# EAGLE design AU_MacroPad (EAGLE 9.6.2)
COMPANY: ADAFRUIT INDUSTRIES; DRAWN: KTOWN; REV: A

## Sheet 1 of 2
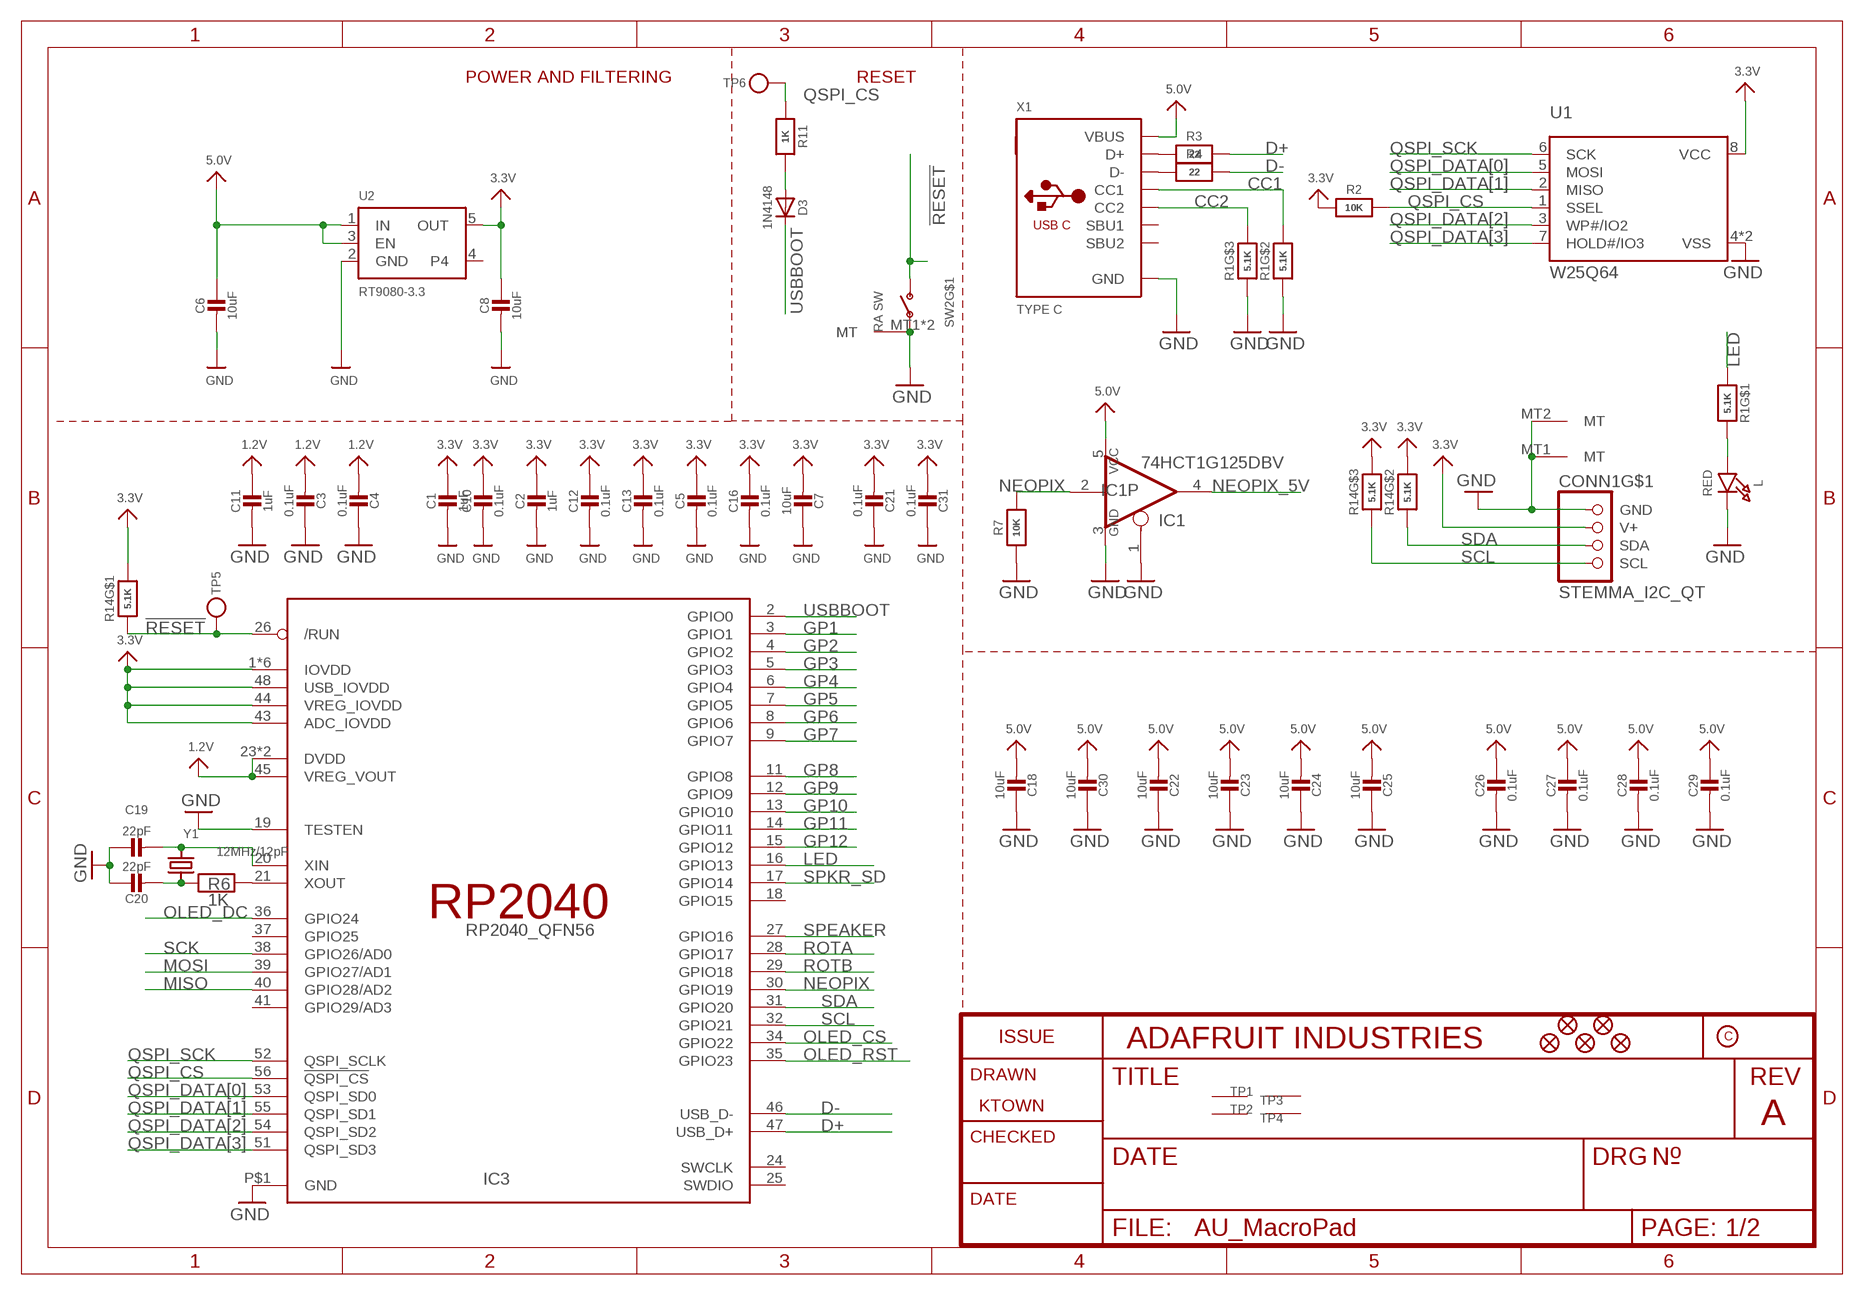
[diagram p0: schematic, sheet 1]

### Parts
C1  1uF  CAP_CERAMIC0603_NO  [0603-NO]
C2  1uF  CAP_CERAMIC0603_NO  [0603-NO]
C3  0.1uF  CAP_CERAMIC0603_NO  [0603-NO]
C4  0.1uF  CAP_CERAMIC0603_NO  [0603-NO]
C5  0.1uF  CAP_CERAMIC0603_NO  [0603-NO]
C6  10uF  CAP_CERAMIC0805-NOOUTLINE  [0805-NO]
C7  10uF  CAP_CERAMIC0805-NOOUTLINE  [0805-NO]
C8  10uF  CAP_CERAMIC0805-NOOUTLINE  [0805-NO]
C10  0.1uF  CAP_CERAMIC0603_NO  [0603-NO]
C11  1uF  CAP_CERAMIC0603_NO  [0603-NO]
C12  0.1uF  CAP_CERAMIC0603_NO  [0603-NO]
C13  0.1uF  CAP_CERAMIC0603_NO  [0603-NO]
C16  0.1uF  CAP_CERAMIC0603_NO  [0603-NO]
C18  10uF  CAP_CERAMIC0805-NOOUTLINE  [0805-NO]
C19  22pF  CAP_CERAMIC0603_NO  [0603-NO]
C20  22pF  CAP_CERAMIC0603_NO  [0603-NO]
C21  0.1uF  CAP_CERAMIC0603_NO  [0603-NO]
C22  10uF  CAP_CERAMIC0805-NOOUTLINE  [0805-NO]
C23  10uF  CAP_CERAMIC0805-NOOUTLINE  [0805-NO]
C24  10uF  CAP_CERAMIC0805-NOOUTLINE  [0805-NO]
C25  10uF  CAP_CERAMIC0805-NOOUTLINE  [0805-NO]
C26  0.1uF  CAP_CERAMIC0603_NO  [0603-NO]
C27  0.1uF  CAP_CERAMIC0603_NO  [0603-NO]
C28  0.1uF  CAP_CERAMIC0603_NO  [0603-NO]
C29  0.1uF  CAP_CERAMIC0603_NO  [0603-NO]
C30  10uF  CAP_CERAMIC0805-NOOUTLINE  [0805-NO]
C31  0.1uF  CAP_CERAMIC0603_NO  [0603-NO]
CONN1  STEMMA_I2C_QT  [JST_SH4]
D3  1N4148  DIODESOD-323  [SOD-323]
IC1  74HCT1G125DBV  74AHC1G125DBV  [SOT23-5]
IC3  RP2040_QFN56  [QFN56_7MM_REDUCEDEPAD]
L  RED  LED0603_NOOUTLINE  [CHIPLED_0603_NOOUTLINE]
R1  5.1K  RESISTOR_4PACK  [RESPACK_4X0603]
R2  10K  RESISTOR_0603_NOOUT  [0603-NO]
R3  22  RESISTOR_0603_NOOUT  [0603-NO]
R4  22  RESISTOR_0603_NOOUT  [0603-NO]
R6  1K  RESISTOR_0603_NOOUT  [0603-NO]
R7  10K  RESISTOR_0603_NOOUT  [0603-NO]
R11  1K  RESISTOR_0603_NOOUT  [0603-NO]
R14  5.1K  RESISTOR_4PACK  [RESPACK_4X0603]
SW2  RA SW  SWITCH_SPST_MNT_TACT_RA  [SPST_TACTILE_RA]
TP1  SEWTAP_SMTNUTM3  [SMT_NUT_3MM]
TP2  SEWTAP_SMTNUTM3  [SMT_NUT_3MM]
TP3  SEWTAP_SMTNUTM3  [SMT_NUT_3MM]
TP4  SEWTAP_SMTNUTM3  [SMT_NUT_3MM]
TP5  TESTPOINTROUND1.5MMNO  [TESTPOINT_ROUND_1.5MM_NO]
TP6  TESTPOINTROUND1.5MMNO  [TESTPOINT_ROUND_1.5MM_NO]
U1  W25Q64  SPIFLASH_8PIN_4X4  [USON8_4X4]
U2  RT9080-3.3  VREG_SOT23-5  [SOT23-5]
U$34  FIDUCIAL_1MM  [FIDUCIAL_1MM]
U$35  FIDUCIAL_1MM  [FIDUCIAL_1MM]
U$79  FIDUCIAL_1MM  [FIDUCIAL_1MM]
U$80  FIDUCIAL_1MM  [FIDUCIAL_1MM]
U$83  FIDUCIAL_1MM  [FIDUCIAL_1MM]
X1  TYPE C  USB_C  [USB_C_CUSB31-CFM2AX-01-X]
Y1  12MHz/12pF  CRYSTAL2.5X2.0  [CRYSTAL_2.5X2]

### Nets
1.2V: C3.2 C4.2 C11.1 IC3.23(DVDD) IC3.45(VREG_VOUT) IC3.50(DVDD)
3.3V [power]: C1.1 C2.1 C5.1 C7.2 C8.1 C10.1 C12.1 C13.1 C16.1 C21.2 C31.2 CONN1.2(V+) IC3.1(IOVDD) IC3.10(IOVDD) IC3.22(IOVDD) IC3.33(IOVDD) IC3.42(IOVDD) IC3.43(ADC_IOVDD) IC3.44(VREG_IOVDD) IC3.48(USB_IOVDD) IC3.49(IOVDD) R2.1 R14.6 R14.7 R14.8 U1.8(VCC) U2.5(OUT) ; also sheet 2
5.0V [5V]: C6.1 C18.2 C22.2 C23.2 C24.2 C25.2 C26.1 C27.1 C28.1 C29.1 C30.2 IC1.5(VCC) U2.1(IN) U2.3(EN) X1.A4B9(VBUS) X1.B4A9(VBUS) ; also sheet 2
!RESET: IC3.26(/RUN) R14.1 SW2.2(S) TP5.P$1
CC1: R1.7 X1.A5(CC1)
CC2: R1.6 X1.B5(CC2)
D+: IC3.47(USB_D+) R3.2
D-: IC3.46(USB_D-) R4.2
GND: C1.2 C2.2 C3.1 C4.1 C5.2 C6.2 C7.1 C8.2 C10.2 C11.2 C12.2 C13.2 C16.2 C18.1 C19.1 C20.1 C21.1 C22.1 C23.1 C24.1 C25.1 C26.2 C27.2 C28.2 C29.2 C30.1 C31.1 CONN1.1(GND) CONN1.MT1(MT) CONN1.MT2(MT) IC1.1(OE) IC1.3(GND) IC3.19(TESTEN) IC3.P$1(GND) L.C R1.2 R1.3 R7.1 SW2.1(P) SW2.MT1(MT) SW2.MT2(MT) U1.4(VSS) U1.PAD(VSS) U2.2(GND) X1.A1B12(GND) X1.B1A12(GND) ; also sheet 2
GP1: IC3.3(GPIO1) ; also sheet 2
GP2: IC3.4(GPIO2) ; also sheet 2
GP3: IC3.5(GPIO3) ; also sheet 2
GP4: IC3.6(GPIO4) ; also sheet 2
GP5: IC3.7(GPIO5) ; also sheet 2
GP6: IC3.8(GPIO6) ; also sheet 2
GP7: IC3.9(GPIO7) ; also sheet 2
GP8: IC3.11(GPIO8) ; also sheet 2
GP9: IC3.12(GPIO9) ; also sheet 2
GP10: IC3.13(GPIO10) ; also sheet 2
GP11: IC3.14(GPIO11) ; also sheet 2
GP12: IC3.15(GPIO12) ; also sheet 2
LED: IC3.16(GPIO13) R1.1
MISO: IC3.40(GPIO28/AD2)
MOSI: IC3.39(GPIO27/AD1) ; also sheet 2
N$1: R3.1 X1.A6(D+) X1.B6(D+)
N$2: L.A R1.8
N$3: R4.1 X1.A7(D-) X1.B7(D-)
N$4: D3.A R11.2
N$5: C19.2 IC3.20(XIN) Y1.3
N$6: C20.2 R6.1 Y1.1
N$7: IC3.21(XOUT) R6.2
NEOPIX: IC1.2(I) IC3.30(GPIO19) R7.2
NEOPIX_5V: IC1.4(O) ; also sheet 2
OLED_CS: IC3.34(GPIO22) ; also sheet 2
OLED_DC: IC3.36(GPIO24) ; also sheet 2
OLED_RST: IC3.35(GPIO23) ; also sheet 2
QSPI_CS: IC3.56(!QSPI_CS) R2.2 R11.1 TP6.P$1 U1.1(SSEL)
QSPI_DATA[0]: IC3.53(QSPI_SD0) U1.5(MOSI)
QSPI_DATA[1]: IC3.55(QSPI_SD1) U1.2(MISO)
QSPI_DATA[2]: IC3.54(QSPI_SD2) U1.3(WP#/IO2)
QSPI_DATA[3]: IC3.51(QSPI_SD3) U1.7(HOLD#/IO3)
QSPI_SCK: IC3.52(QSPI_SCLK) U1.6(SCK)
ROTA: IC3.28(GPIO17) ; also sheet 2
ROTB: IC3.29(GPIO18) ; also sheet 2
SCK: IC3.38(GPIO26/AD0) ; also sheet 2
SCL: CONN1.4(SCL) IC3.32(GPIO21) R14.3
SDA: CONN1.3(SDA) IC3.31(GPIO20) R14.2
SPEAKER: IC3.27(GPIO16) ; also sheet 2
SPKR_SD: IC3.17(GPIO14) ; also sheet 2
USBBOOT: D3.C IC3.2(GPIO0) ; also sheet 2
Unconnected: IC3.18(GPIO15) IC3.24(SWCLK) IC3.25(SWDIO) IC3.37(GPIO25) IC3.41(GPIO29/AD3) R1.4 R1.5 TP1.P$1(SEW) TP2.P$1(SEW) TP3.P$1(SEW) TP4.P$1(SEW) U2.4 X1.A8(SBU1) X1.B8(SBU2)

### Notes on the sheet
- POWER AND FILTERING | RESET

## Sheet 2 of 2
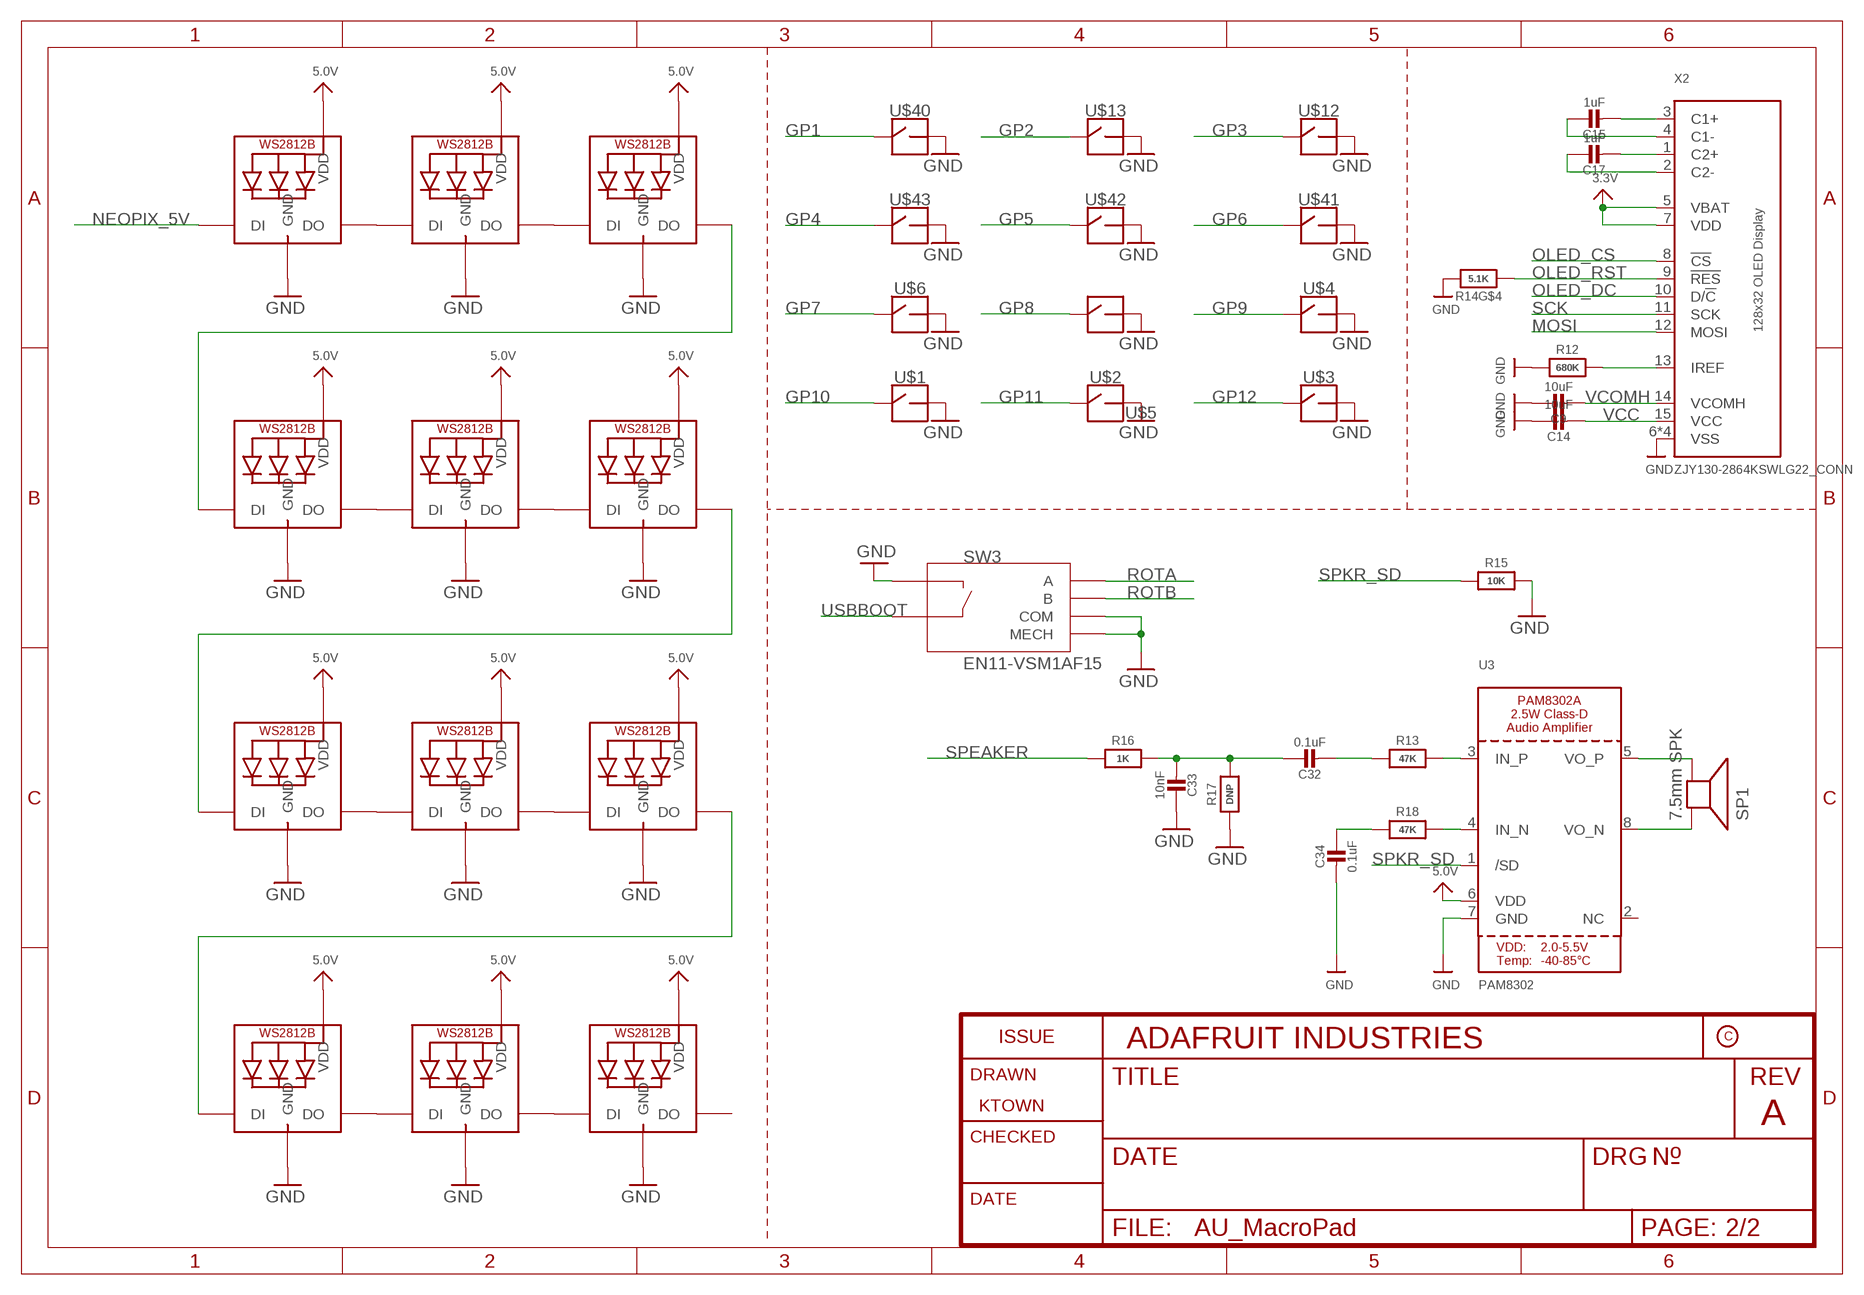
[diagram p1: schematic, sheet 2]

### Parts
C9  10uF  CAP_CERAMIC0805-NOOUTLINE  [0805-NO]
C14  10uF  CAP_CERAMIC0805-NOOUTLINE  [0805-NO]
C15  1uF  CAP_CERAMIC0603_NO  [0603-NO]
C17  1uF  CAP_CERAMIC0603_NO  [0603-NO]
C32  0.1uF  CAP_CERAMIC0603_NO  [0603-NO]
C33  10nF  CAP_CERAMIC0603_NO  [0603-NO]
C34  0.1uF  CAP_CERAMIC0603_NO  [0603-NO]
LED1  WS2812B_SK6812E  [NEO3535_REVERSE]
LED2  WS2812B_SK6812E  [NEO3535_REVERSE]
LED3  WS2812B_SK6812E  [NEO3535_REVERSE]
LED4  WS2812B_SK6812E  [NEO3535_REVERSE]
LED5  WS2812B_SK6812E  [NEO3535_REVERSE]
LED6  WS2812B_SK6812E  [NEO3535_REVERSE]
LED7  WS2812B_SK6812E  [NEO3535_REVERSE]
LED8  WS2812B_SK6812E  [NEO3535_REVERSE]
LED9  WS2812B_SK6812E  [NEO3535_REVERSE]
LED10  WS2812B_SK6812E  [NEO3535_REVERSE]
LED11  WS2812B_SK6812E  [NEO3535_REVERSE]
LED12  WS2812B_SK6812E  [NEO3535_REVERSE]
R12  680K  RESISTOR_0603_NOOUT  [0603-NO]
R13  47K  RESISTOR_0603_NOOUT  [0603-NO]
R15  10K  RESISTOR_0603_NOOUT  [0603-NO]
R16  1K  RESISTOR_0603_NOOUT  [0603-NO]
R17  DNP  RESISTOR_0603_NOOUT  [0603-NO]
R18  47K  RESISTOR_0603_NOOUT  [0603-NO]
SP1  7.5mm SPK  SPEAKER_7.5MM  [BUZZER_SMT_7.5MM]
SW3  EN11-VSM1AF15  [EN11-VSM1AF15]
U3  PAM8302  AUDIOAMP_PAM8302A  [MSOP8_0.65MM]
U$1  SOCKET  KBD_SWITCH_KAILH_SOCKETBOX_JADE_KAILH_SOCKET  [KAILH_SOCKET]
U$2  SOCKET  KBD_SWITCH_KAILH_SOCKETBOX_JADE_KAILH_SOCKET  [KAILH_SOCKET]
U$3  SOCKET  KBD_SWITCH_KAILH_SOCKETBOX_JADE_KAILH_SOCKET  [KAILH_SOCKET]
U$4  SOCKET  KBD_SWITCH_KAILH_SOCKETBOX_JADE_KAILH_SOCKET  [KAILH_SOCKET]
U$5  SOCKET  KBD_SWITCH_KAILH_SOCKETBOX_JADE_KAILH_SOCKET  [KAILH_SOCKET]
U$6  SOCKET  KBD_SWITCH_KAILH_SOCKETBOX_JADE_KAILH_SOCKET  [KAILH_SOCKET]
U$12  SOCKET  KBD_SWITCH_KAILH_SOCKETBOX_JADE_KAILH_SOCKET  [KAILH_SOCKET]
U$13  SOCKET  KBD_SWITCH_KAILH_SOCKETBOX_JADE_KAILH_SOCKET  [KAILH_SOCKET]
U$40  SOCKET  KBD_SWITCH_KAILH_SOCKETBOX_JADE_KAILH_SOCKET  [KAILH_SOCKET]
U$41  SOCKET  KBD_SWITCH_KAILH_SOCKETBOX_JADE_KAILH_SOCKET  [KAILH_SOCKET]
U$42  SOCKET  KBD_SWITCH_KAILH_SOCKETBOX_JADE_KAILH_SOCKET  [KAILH_SOCKET]
U$43  SOCKET  KBD_SWITCH_KAILH_SOCKETBOX_JADE_KAILH_SOCKET  [KAILH_SOCKET]
X2  ZJY130-2864KSWLG22_CONN  [ZJY130-2864KSWLG22_JUSTCONN]

### Nets
3.3V [power]: X2.5(VBAT) X2.7(VDD) ; also sheet 1
5.0V [5V]: LED1.1-VDD(VDD) LED2.1-VDD(VDD) LED3.1-VDD(VDD) LED4.1-VDD(VDD) LED5.1-VDD(VDD) LED6.1-VDD(VDD) LED7.1-VDD(VDD) LED8.1-VDD(VDD) LED9.1-VDD(VDD) LED10.1-VDD(VDD) LED11.1-VDD(VDD) LED12.1-VDD(VDD) U3.6(VDD) ; also sheet 1
GND: C9.1 C14.1 C33.1 C34.2 LED1.3-GND(GND) LED2.3-GND(GND) LED3.3-GND(GND) LED4.3-GND(GND) LED5.3-GND(GND) LED6.3-GND(GND) LED7.3-GND(GND) LED8.3-GND(GND) LED9.3-GND(GND) LED10.3-GND(GND) LED11.3-GND(GND) LED12.3-GND(GND) R12.1 R14.5 R15.2 R17.1 SW3.C(COM) SW3.D SW3.P$1(MECH) SW3.P$2(MECH) U3.7(GND) U$1.2 U$2.2 U$3.2 U$4.2 U$5.2 U$6.2 U$12.2 U$13.2 U$40.2 U$41.2 U$42.2 U$43.2 X2.6(VSS) X2.16(VSS) X2.SUPPORT1(VSS) X2.SUPPORT2(VSS) ; also sheet 1
GP1: U$40.1 ; also sheet 1
GP2: U$13.1 ; also sheet 1
GP3: U$12.1 ; also sheet 1
GP4: U$43.1 ; also sheet 1
GP5: U$42.1 ; also sheet 1
GP6: U$41.1 ; also sheet 1
GP7: U$6.1 ; also sheet 1
GP8: U$5.1 ; also sheet 1
GP9: U$4.1 ; also sheet 1
GP10: U$1.1 ; also sheet 1
GP11: U$2.1 ; also sheet 1
GP12: U$3.1 ; also sheet 1
IN+: R13.2 U3.3(IN_P)
IN-: R18.2 U3.4(IN_N)
MOSI: X2.12(MOSI) ; also sheet 1
N$10: LED1.2-DOUT(DO) LED2.4-DIN(DI)
N$11: LED2.2-DOUT(DO) LED3.4-DIN(DI)
N$12: LED4.2-DOUT(DO) LED5.4-DIN(DI)
N$13: LED5.2-DOUT(DO) LED6.4-DIN(DI)
N$14: LED7.2-DOUT(DO) LED8.4-DIN(DI)
N$15: LED8.2-DOUT(DO) LED9.4-DIN(DI)
N$16: LED10.2-DOUT(DO) LED11.4-DIN(DI)
N$17: LED11.2-DOUT(DO) LED12.4-DIN(DI)
N$18: LED3.2-DOUT(DO) LED4.4-DIN(DI)
N$19: LED6.2-DOUT(DO) LED7.4-DIN(DI)
N$20: LED9.2-DOUT(DO) LED10.4-DIN(DI)
N$21: R12.2 X2.13(IREF)
N$23: C17.1 X2.2(C2-)
N$24: C17.2 X2.1(C2+)
N$25: C15.1 X2.4(C1-)
N$26: C15.2 X2.3(C1+)
N$28: C32.2 R13.1
N$29: C32.1 C33.2 R16.2 R17.2
N$30: C34.1 R18.1
N$31: SP1.- U3.5(VO_P)
N$32: SP1.+ U3.8(VO_N)
NEOPIX_5V: LED1.4-DIN(DI) ; also sheet 1
OLED_CS: X2.8(!CS) ; also sheet 1
OLED_DC: X2.10(D/!C) ; also sheet 1
OLED_RST: R14.4 X2.9(!RES) ; also sheet 1
ROTA: SW3.A ; also sheet 1
ROTB: SW3.B ; also sheet 1
SCK: X2.11(SCK) ; also sheet 1
SPEAKER: R16.1 ; also sheet 1
SPKR_SD: R15.1 U3.1(/SD) ; also sheet 1
USBBOOT: SW3.E ; also sheet 1
VCC: C14.2 X2.15(VCC)
VCOMH: C9.2 X2.14(VCOMH)
Unconnected: LED12.2-DOUT(DO) U3.2(NC)

## Library data of the parts
C1-C7 C9-C34 = microbuilder:CAP_CERAMIC: Ceramic Capacitors For new designs, use the packages preceded by an '_' character since they are more reliable: The following footprints should be used on most boards: _0402 - Standard footprint for regular board layouts _0603 - Standard footprint for regular board layouts _0805 - Standard footprint for regular board layouts _1206 - Standard footprint for regular board layouts For extremely tight-pitch boards where space is at a premium, the following 'micro-pitch' footprints can be used (smaller pads, no silkscreen outline, etc.): _0402MP - Micro-pitch footprint for very dense/compact boards _0603MP - Micro-pitch footprint for very dense/compact boards _0805MP - Micro-pitch footprint for very dense/compact boards _1206MP - Micro-pitch footprint for very dense/compact boards
C8 = microbuilder:CAP_CERAMIC: Ceramic Capacitors For new designs, use the packages preceded by an '_' character since they are more reliable: The following footprints should be used on most boards: _0402 - Standard footprint for regular board layouts _0603 - Standard footprint for regular board layouts _0805 - Standard footprint for regular board layouts _1206 - Standard footprint for regular board layouts For extremely tight-pitch boards where space is at a premium, the following 'micro-pitch' footprints can be used (smaller pads, no silkscreen outline, etc.): _0402MP - Micro-pitch footprint for very dense/compact boards _0603MP - Micro-pitch footprint for very dense/compact boards _0805MP - Micro-pitch footprint for very dense/compact boards _1206MP - Micro-pitch footprint for very dense/compact boards; REV: D
CONN1 = adafruit_electromech:STEMMA_I2C; LCSC: C2845363
D3 = microbuilder:DIODE: Diode SMA Model Volts Amps Type Vf Ir Digikey # Notes SSA34-E3 40V 3A Schottky 480mV @ 3A 200uA @ 40V SSA34-E3/61TGITR-ND CDBA120-G 20V 1A Schottky 500mV @ 1A 500uA @ 20V 641-1014-6-ND REEL MBRA210 10V 2A Schottky 350mV @ 2A 700uA @ 10V MBRA210LT3 SOD-123 Model Volts Amps Type Vf Ir Order # Notes BAT54T1G 30V 200mA Schottky 800mV @ 200mA 2uA @ 25V BAT54T1GOSTR-ND B0530W 30V 500mA Schottky 430mV @ 500mA 130uA @ 30V B0530W-FDICT-ND REEL MBR120 20V 1A Schottky 340mV @ 1A MBR120VLSFT1GOSCT-ND SOD-323 Model Volts Amps Type Vf Ir Order # Notes PMEG2005EJ 20V 500mA Schottky 355mV @ 500mA 568-4110-1-ND ZLLS410 10V 570mA Schottky 380mV @ 570mA ZLLS410CT-ND 1N4148WS 75V 150mA Silicon/Simple 1V 1N4148WSFSCT-ND REEL SOD-523 Model Volts Amps Type Vf Ir Order # Notes BAT54XV2 30V 200mA Schottky 0.8V @ 100mA BAT54XV2CT-ND TB751S 30V 30mA Schottky RB751S-40TE61CT-ND SOT23-R/W (R = Solder Paste/Reflow Ovens, W = Hand-Soldering) Model Volts Amps Type Vf Ir Order # Notes BAT54FILM 40V 300mA Schottky 497-7162-1-ND POWERDI-5 Model Volts Amps Type Vf Ir Order # Notes PDS560 60V 5A Schottky 670mV @ 5A 150uA @ 60V PDS560DICT-ND
IC1 = 74xx-little-us:74*1G125: Single Bus Buffer Gate with 3-State Output
IC3 = adafruit_micro:RP2040; LCSC: C2040
L = microbuilder:LED: LED 0603 - 0603 Surface Mount Package 2mA: Green LED - Low Power (3.9mcd, 2ma, 1.7Vf) - Digikey: 475-2709-2-ND Orange LED - Low Power (9.8mcd, 2ma, 1.8Vf) - Digikey: 475-1194-2-ND Red LED - Low Power (5mcd, 2ma, 1.8Vf) - Digikey: 475-1195-2-ND Yellow LED - Low Power (7mcd, 2ma, 1.8Vf) - Digikey: 475-1196-2-ND 5mA: Blue LED - Low Power (17mcd, 5ma, 2.9Vf) - Digikey: LNJ937W8CRACT-ND 0805 - 0805 Surface Mount Package 2mA: Red LED (8.8mcd, 2mA, 1.8Vf, Clear) - Low Power [Digikey: 475-2510-1-ND] Green LED (5mcd, 2mA, 1.8Vf, Clear) - Low Power [Digikey: 475-2730-1-ND] Yellow LED (11.3mcd, 2mA, 1.8Vf, Clear) - Low Power [Digikey: 475-2555-1-ND] 20mA: Red LED (104mcd, 20mA, Diffused) - LS R976 [Digikey: 475-1278-6-ND] Red LED (12mcd, 20mA, 2.0Vf, Clear) - APT2012EC [Digikey: 754-1128-1-ND] Green LED (15mcd, 20mA, 2.2Vf, Clear) - APT2012GC [Digikey: 754-1131-1-ND] Orange LED (160mcd, 20mA, 2.1Vf, Clear) - APT2012SECK [Digikey: 754-1130-1-ND] 1206 - 1206 Surface Mount Package Green LED (26mcd, 20mA, Diffused) - LG N971 [Digikey: 475-1407-6-ND] Red LED (15mcd, 20mA, Diffused) - LH N974 [Digikey: 475-1416-6-ND] Cree - Cree High-Power Surface Mount LEDs XPEBWT-L1-0000-00D50 - White 111lm 350mA 2.9Vf 6200K 110° XTEAWT-00-0000-00000LEE3 - White 114lm 350mA 2.85Vf 5000K 115° Everlight - Everlight 45-21 Series Surface Mount LEDs 45-21/QK2C-B2832AC2CB2/2T - Warm White 2000mcd 20mA 3.25Vf 3050K 120° 45-21/LK2C-B38452C4CB2/2T - Nuetral White 2000mcd 20mA 3.25Vf 4150K 120° 45-21/LK2C-B50634C6CB2/2T - Cold White 2200mcd 20mA 3.25Vf 5650K 120° PLCC2 Reverse Mount LS T77K-J1L2-1-0-2-R18-Z - Red 11.25mcd 2mA 1.8Vf 630nm 120° LO T77K-L1M2-24-Z - Orange 19.6mcd 2mA 1.8Vf 606nm 120° LY T77K-K2M1-26-Z - Yellow 15.7mcd 2mA 1.8Vf 587nm 120°; ROT: 270
LED1-LED12 = microbuilder:WS2812B
R1 R14 = microbuilder:RESISTOR_4PACK: Resistor Packs (4 resistors) 4 x 0603 10K 1/16W - Digikey: YC164J-10KCT-ND
R2-R4 R6 R7 R11-R13 R15-R18 = microbuilder:RESISTOR: Resistors For new designs, use the packages preceded by an '_' character since they are more reliable: The following footprints should be used on most boards: _0402 - Standard footprint for regular board layouts _0603 - Standard footprint for regular board layouts _0805 - Standard footprint for regular board layouts _1206 - Standard footprint for regular board layouts For extremely tight-pitch boards where space is at a premium, the following 'micro-pitch' footprints can be used (smaller pads, no silkscreen outline, etc.): _0402MP - Micro-pitch footprint for very dense/compact boards _0603MP - Micro-pitch footprint for very dense/compact boards _0805MP - Micro-pitch footprint for very dense/compact boards _1206MP - Micro-pitch footprint for very dense/compact boards
SP1 = microbuilder:SPEAKER: SPEAKER Source: Buerklin Added PS12 (for part # PS1240 piezo) http://www.ladyada.net/library/pcb/eaglelibrary.html; ROT: 0
SW2 = adafruit_electromech:SWITCH_SPST_MNT: Switch - SPST 4UCon 19192 (6.7x2.6mm SMT); LCSC: C778159
SW3 = Keypad Lib:EN11-VSM1AF15
TP1-TP4 = adafruit_electromech:SEWTAP; FORCETHM: 1
TP5 TP6 = microbuilder:TESTPOINT: Test Point Various test points for characterisation and PCB testing TESTPOINT_SMT - Compact Surface Mount Test Point [Digikey: 5016KTR-ND]
U1 = microbuilder:SPIFLASH_8PIN: SOIC8 SPI Flash Be careful with the size since SOIC8 flash comes in several 'widths' SOIC8 150 mil M25P16 - 16Mbit (2Mbit x 8) Serial Flash (75MHz SPI Bus), Supply: 2.7-3.6V Digikey: SOIC8 - M25P16-VMN6P-ND SOIC8 208 mil W25Q16BVSSIG - 16Mbit (2Mbit x 8) Serial Flash (104MHz SPI Bus), Supply: 2.7-3.6V Digikey: SOIC8 - W25Q16BVSSIG-ND
U2 = adafruit_power:VREG_SOT23-5: SOT23-5 Fixed Voltage Regulators Part Current Out V Out V In V Dropout θJA (°C/W) TJ (°C) Digikey Part No. ADP121 150mA 3.3V 3.4-5.5V 0.09V @ 150mA -- -- ADP121-AUJZ33R7CT-ND ADP121 150mA 3.0V 3.1-5.5V 0.09V @ 150mA -- -- ADP121-AUJZ30R7CT-ND ADP122 300mA 3.3V 3.4-5.5V 0.085V @ 300mA -- -- ADP122AUJZ-3.3-R7CT-ND ADP1712 300mA 3.3V 3.5-5.5V 0.17V @ 300mA -- -- ADP1712AUJZ-3.3-R7TR-ND AP7311 (Low Cost) 150mA 3.3V 3.5-6V 0.15V @ 150mA -- -- AP7311-33WG-7DICT-ND LD39015M18R 150mA 1.8V 1.9V-5.5V 0.08V @ 100mA -- -- 497-6977-1-ND LP2985A-33DBVR 150mA 3.3V 3.3-16V 0.28V @ 150mA 206 150 296-18479-1-ND MCP1824T-3302E/OT 300mA 3.3V 3.5V-6V 0.2V @ 300mA -- -- MCP1824T-3302E/OTCT-ND MIC5205-2.5YM5 TR 150mA 2.5V 2.7-16V 0.165V @ 150mA -- -- 576-1257-2-ND MIC5205-3.0YM5 TR 150mA 3.0V 3.2V-16V 0.165V @ 150mA -- -- 576-1258-2-ND MIC5205-3.3YM5 TR 150mA 3.3V 3.5V-16V 0.165V @ 150mA -- -- 576-1259-2-ND TPS780330220 150mA 3.3V+2.2V 3.6-5.5V 250mV Max -- -- 296-23332-1-ND TDA3663/N1,135 100mA 3.3V 3.5-45V 0.18V @ 50mA -- -- 568-5343-1-ND Max operating temp can be calculated using θJA, TJ (max junction temperature), and power in watts. Set the "Maximum Ambient Temperature" until it reaches TJ ("Max Junction Temperature"), which is the absolute limit for safe use of the regulator: Heat Sink Temperature Calculator <http://www.daycounter.com/Calculators/Heat-Sink-Temperature-Calculator.phtml> For example, With 12V source into a 3.3V LP2985 and a 30mA load, we are dissipating (12V-3.3V) * 0.03A = 0.261W. With a θJA of 206 °C/W, a TJ of 150°C, and 261mW we can safely use the chip without a heat sink up to 75°C (=147.1°C Junction Temperature).; JLC_ROTATION: 0
U3 = microbuilder:AUDIOAMP_PAM8302A: PAM8302A - 2.5W Class-D Mono Audio Amplifier MSOP8 = PAM8302AASCR
U$1-U$6 U$12 U$13 U$40-U$43 = adafruit_electromech:KBD_SWITCH_KAILH_SOCKET; ROT: 180; XOFFSET: -0.75; YOFFSET: 3.75
U$34 U$35 U$79 U$80 U$83 = microbuilder:FIDUCIAL: Fiducial Alignment Points Various fiducial points for machine vision alignment.; BOM: EXCLUDE
X1 = adafruit_electromech:USB_C: USB Type-C USB 2.0 Connector; LCSC: C165948
X2 = adafruit_display:ZJY130-2864KSWLG22
Y1 = microbuilder:CRYSTAL: Crystals HC49UP - Surface Mount Crystal 4.0MHz 18pF +/-30ppm Surface Mount Crystal [Digikey: 535-9857-1-ND] 12.0 MHz Surface Mount Crystal [Digikey: 535-9869-6-ND] 25.0 MHz Surface Mount Crystal [Digikey: 535-9078-1-ND] 2.5 x 2.0mm - MEMs SMT Crystal 16.0 MHz 10pF 20ppm 2.5 x 2.0mm Crystal [Digikey -40-85°C: 535-10923-1-ND] 3.2 x 2.5mm - MEMs SMT Crystal 12.0 MHz 8pF 15ppm 3.2 x 2.5mm Crystal [Digikey: -10-70°C: 644-1047-1-ND -40-125°C: 644-1128-1-ND] 40~85°C cheaper: 644-1173-6-ND 16.0 MHz 8pF 15ppm 3.2 x 2.5mm Crystal [Digikey: -10-70°C: 644-1049-1-ND -40-125°C: 644-1129-2-ND]-40~85°C cheaper: 644-1175-6-ND 16.0 MHz 10pF 10ppm 3.2 x 2.5mm Crystal [Digikey: 644-1100-1-ND] 27.12 MHz 18pF 30ppm 3.2 x 2.5mm Crystal [Digikey: 887-1424-1-ND] 27.12MHz 10pF 10ppm 3.2 x 2.5mm Crystal [Digikey: 887-1329-1-ND] 4.9 x 1.8mm - MEMs SMT Crystal 32.768 KHz 12.5pF 20ppm 4.9 x 1.8mm Crystal [Digikey: SE2415CT-ND] 8.0 x 3.8mm - Surface Mount Crystal 32.768kHz 12.5pF 20ppm -40°C-85°C [Digikey: 535-9166-2-ND] Cylinder 32.768KHz Cylinder Crystal (2x6mm body) [Ex. Digikey: 300-8341-2-ND]

## Net classes
1 power: width 0.254 mm
2 5V: width 0.406 mm, drill 0.483 mm

## Board
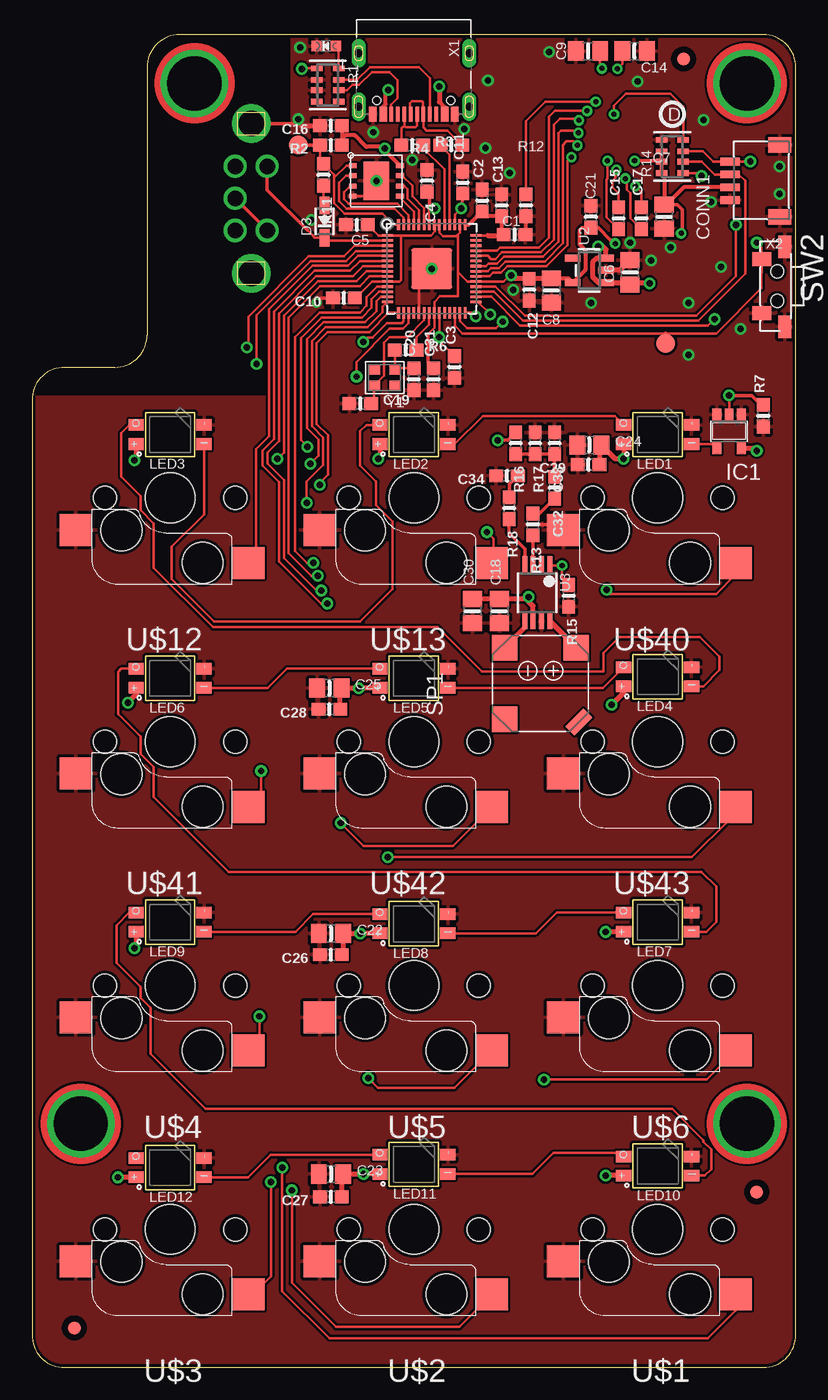
[diagram p2: board, top side]
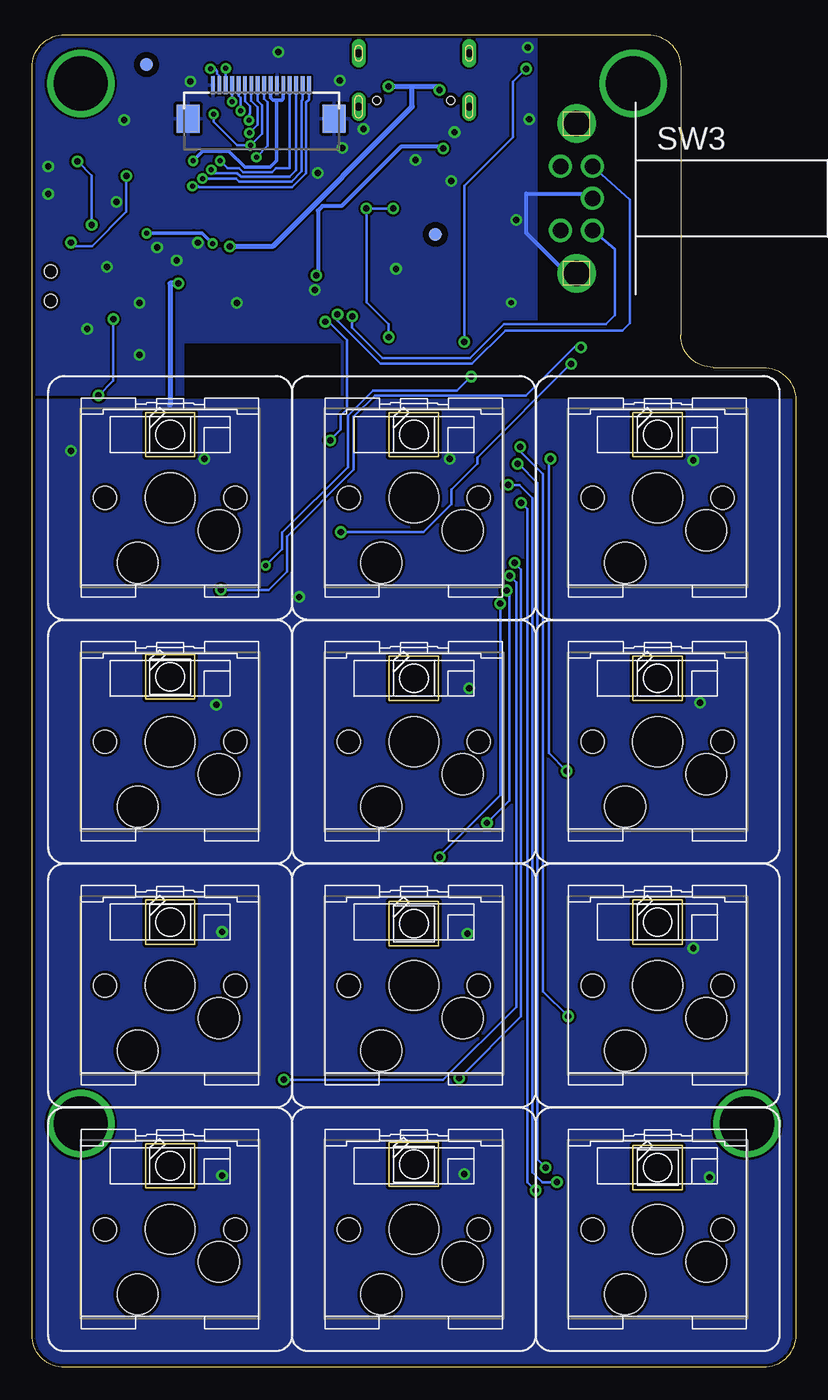
[diagram p3: board, bottom side, seen from below]

Size 59.69 x 104.14 mm. Coordinates in mm from the lower left corner, seen from the top.
Outline: 46.97,14.02 46.97,17.48 50.82,17.48 50.82,14.02 46.97,14.02
Outline: 8.87,33.07 8.87,36.52 12.72,36.52 12.72,33.07 8.87,33.07
Outline: 27.92,32.94 27.92,36.4 31.77,36.4 31.77,32.94 27.92,32.94
Outline: 46.97,33.07 46.97,36.52 50.82,36.52 50.82,33.07 46.97,33.07
Outline: 8.87,52.12 8.87,55.58 12.72,55.58 12.72,52.12 8.87,52.12
Outline: 27.92,52.12 27.92,55.58 31.77,55.58 31.77,52.12 27.92,52.12
Outline: 46.97,52.25 46.97,55.7 50.82,55.7 50.82,52.25 46.97,52.25
Outline: 8.87,71.17 8.87,74.62 12.72,74.62 12.72,71.17 8.87,71.17
Outline: 27.92,14.15 27.92,17.6 31.77,17.6 31.77,14.15 27.92,14.15
Outline: 46.97,71.17 46.97,74.62 50.82,74.62 50.82,71.17 46.97,71.17
Outline: 27.92,71.17 27.92,74.62 31.77,74.62 31.77,71.17 27.92,71.17
Outline: 8.87,13.89 8.87,17.35 12.72,17.35 12.72,13.89 8.87,13.89
Outline: 6.46,78.14 2.54,78.14 arc90 0,75.6 0,2.54 arc90 2.54,0 57.15,0 arc90 59.69,2.54 59.69,101.6 arc90 57.15,104.14 11.54,104.14 arc90 9,101.6 9,80.68 arc-90 6.46,78.14
Copper layers (1*16): Top 0.035mm / dielectric 1.5mm / Bottom 0.035mm
Design rules "adafruit 7-7": minimum track width 7mil, minimum drill 15.5mil, track to track 7mil, track to pad 7mil, pad to pad 7mil, via to via 7mil, smd to smd 7mil, copper to edge 10mil, drill to drill 8mil, minimum pad ring 10mil, minimum via ring 8mil, stop-mask expansion 2mil, vias tented up to drill 20mil, thermal gap 10mil
bRestrict: area 35.6,75.7 to 47.8,80

### Footprints (pad centres in the part's own frame; a part is rotated, then mirrored left to right if it is on the bottom)
0603-NO = smd 1.075 x 1: 1 -0.85,0; 2 0.85,0
0805-NO = smd 1.24 x 1.5: 1 -0.95,0; 2 0.95,0
JST_SH4 = smd 0.6 x 1.55: 1 -1.5,2.006; 2 -0.5,2.006; 3 0.5,2.006; 4 1.5,2.006 | smd 1.2 x 1.8: MT1 -2.8,-1.894; MT2 2.8,-1.894
SOD-323 = smd 1.35 x 0.8: A 1.27,0; C -1.27,0
SOT23-5 = smd 0.69 x 0.99: 1 -0.95,-1.29; 2 0,-1.29; 3 0.95,-1.29; 4 0.95,1.3; 5 -0.95,1.3
QFN56_7MM_REDUCEDEPAD = smd 0.875 x 0.2: 1 -3.45,2.6; 2 -3.45,2.2; 3 -3.45,1.8; 4 -3.45,1.4; 5 -3.45,1; 6 -3.45,0.6; 7 -3.45,0.2; 8 -3.45,-0.2; 9 -3.45,-0.6; 10 -3.45,-1; 11 -3.45,-1.4; 12 -3.45,-1.8; 13 -3.45,-2.2; 14 -3.45,-2.6; 29 3.45,-2.6; 30 3.45,-2.2; 31 3.45,-1.8; 32 3.45,-1.4; 33 3.45,-1; 34 3.45,-0.6; 35 3.45,-0.2; 36 3.45,0.2; 37 3.45,0.6; 38 3.45,1; 39 3.45,1.4; 40 3.45,1.8; 41 3.45,2.2; 42 3.45,2.6 | smd 0.2 x 0.875: 15 -2.6,-3.45; 16 -2.2,-3.45; 17 -1.8,-3.45; 18 -1.4,-3.45; 19 -1,-3.45; 20 -0.6,-3.45; 21 -0.2,-3.45; 22 0.2,-3.45; 23 0.6,-3.45; 24 1,-3.45; 25 1.4,-3.45; 26 1.8,-3.45; 27 2.2,-3.45; 28 2.6,-3.45; 43 2.6,3.45; 44 2.2,3.45; 45 1.8,3.45; 46 1.4,3.45; 47 1,3.45; 48 0.6,3.45; 49 0.2,3.45; 50 -0.2,3.45; 51 -0.6,3.45; 52 -1,3.45; 53 -1.4,3.45; 54 -1.8,3.45; 55 -2.2,3.45; 56 -2.6,3.45 | smd 3.2 x 3.2: P$1 0,0
CHIPLED_0603_NOOUTLINE = smd 0.8 x 0.8: A 0,-0.75; C 0,0.75
NEO3535_REVERSE = smd 1.2 x 0.9 bottom: 1-VDD 2.65,-0.75; 2-DOUT 2.65,0.75; 3-GND -2.65,0.75; 4-DIN -2.65,-0.75
RESPACK_4X0603 = smd 0.45 x 0.9: 1 -1.3,-0.85; 2 -0.4,-0.85; 3 0.4,-0.85; 4 1.3,-0.85; 5 1.3,0.85; 6 0.4,0.85; 7 -0.4,0.85; 8 -1.3,0.85
BUZZER_SMT_7.5MM = smd 2 x 2: + 2.8,-2.8; - 2.8,2.8; MT2 -2.8,2.8 | smd 2 x 1 rotated 135: MT -3,-3
SPST_TACTILE_RA = smd 1.1 x 1.5: 1 2.1,-0.9; 2 -2.1,-0.9 | smd 1.75 x 1: MT1 3.175,0.9; MT2 -3.075,0.9 | hole 1: 1.15,0.3; -1.15,0.3
EN11-VSM1AF15 = drill 1.2: A 1.25,-2.5; B 1.25,2.5; C 1.25,0; D -1.25,-2.5; E -1.25,2.5 | drill 2: P$1 0,5.85; P$2 0,-5.85
SMT_NUT_3MM = drill 4.25 pad 4.572: P$1 0,0
TESTPOINT_ROUND_1.5MM_NO = smd 1.5 x 1.5: P$1 0,0
USON8_4X4 = smd 0.6 x 0.4: 1 -1.85,1.2; 2 -1.85,0.4; 3 -1.85,-0.4; 4 -1.85,-1.2; 5 1.85,-1.2; 6 1.85,-0.4; 7 1.85,0.4; 8 1.85,1.2 | smd 2 x 3: PAD 0,0
SOT23-5' = smd 0.55 x 1.2: 1 -0.95,-1.3; 2 0,-1.3; 3 0.95,-1.3; 4 0.95,1.3; 5 -0.95,1.3
MSOP8_0.65MM = smd 0.4 x 1.3: 1 -0.975,-2.2; 2 -0.325,-2.2; 3 0.325,-2.2; 4 0.975,-2.2; 5 0.975,2.2; 6 0.325,2.2; 7 -0.325,2.2; 8 -0.975,2.2
KAILH_SOCKET = smd 2.55 x 2.5 bottom: 1 6.09,5.08; 2 -7.36,2.5 | hole 3.9: 0,0 | hole 3.2: 2.54,5.08; -3.81,2.54 | hole 1.813: 5.08,0; -5.08,0
FIDUCIAL_1MM = smd 1 x 1: 1 0,0
USB_C_CUSB31-CFM2AX-01-X = smd 0.575 x 1.15: A1B12 -3.2,2.275; A4B9 -2.4,2.275; B1A12 3.2,2.275; B4A9 2.4,2.275 | smd 0.275 x 1.15: A5 -1.25,2.275; A6 -0.25,2.275; A7 0.25,2.275; A8 1.25,2.275; B5 1.75,2.275; B6 0.75,2.275; B7 -0.75,2.275; B8 -1.75,2.275 | drill 0.6 pad 1 long: M1 -4.32,1.7; M2 4.32,1.7; M3 -4.32,-2.48; M4 4.32,-2.48 | hole 0.65: 2.89,1.2; -2.89,1.2
ZJY130-2864KSWLG22_JUSTCONN = smd 0.3 x 1.4 bottom: 1 3.75,-1.14; 2 3.25,-1.14; 3 2.75,-1.14; 4 2.25,-1.14; 5 1.75,-1.14; 6 1.25,-1.14; 7 0.75,-1.14; 8 0.25,-1.14; 9 -0.25,-1.14; 10 -0.75,-1.14; 11 -1.25,-1.14; 12 -1.75,-1.14; 13 -2.25,-1.14; 14 -2.75,-1.14; 15 -3.25,-1.14; 16 -3.75,-1.14 | smd 1.8 x 2.2 bottom: SUPPORT1 -5.7,1.488; SUPPORT2 5.7,1.488
CRYSTAL_2.5X2 = smd 0.9 x 0.75: 1 -0.825,-0.625; 2 0.825,-0.625; 3 0.825,0.625; 4 -0.825,0.625

### Placement (x,y rotation side)
C1  37.72,88.52 0 top
C2  35.18,91.19 90 top
C3  33.02,78.17 90 top
C4  30.86,92.71 270 top
C5  25.4,89.28 180 top
C6  46.73,85.56 90 top
C7  49.4,89.92 90 top
C8  40.59,84.14 270 top
C9  43.45,102.86 0 top
C10  24.38,83.57 180 top
C11  33.66,92.58 90 top
C12  38.86,84.2 270 top
C13  36.7,90.81 90 top
C14  47.09,102.86 180 top
C15  45.85,89.79 90 top
C16  23.37,97.03 180 top
C17  47.62,89.79 90 top
C18  36.53,59.11 90 top
C19  25.65,75.31 0 top
C20  29.84,77.22 90 top
C21  43.69,89.92 270 top
C22  23.37,33.91 0 top
C23  23.37,15.11 0 top
C24  43.56,72.07 0 top
C25  23.24,53.09 0 top
C26  23.37,32.26 180 top
C27  23.37,13.34 180 top
C28  23.24,51.44 180 top
C29  43.5,70.55 180 top
C30  34.41,59.11 90 top
C31  31.37,77.22 90 top
C32  40.84,68.74 270 top
C33  40.84,72.21 270 top
C34  37.12,69.67 180 top
CONN1  56.56,92.71 90 top
D3  22.86,89.53 90 top
IC1  54.48,73.15 180 top
IC3  31.24,85.85 0 top
L  22.99,103.25 90 top
LED1  48.9,72.9 0 bottom
LED2  29.84,72.9 0 bottom
LED3  10.79,72.9 0 bottom
LED4  48.9,53.98 0 bottom
LED5  29.84,53.85 0 bottom
LED6  10.79,53.85 0 bottom
LED7  48.9,34.8 0 bottom
LED8  29.84,34.67 0 bottom
LED9  10.79,34.8 0 bottom
LED10  48.9,15.75 0 bottom
LED11  29.84,15.88 0 bottom
LED12  10.79,15.62 0 bottom
R1  23.11,100.2 270 top
R2  23.37,95.5 180 top
R3  29.72,95.5 0 top
R4  32.77,95.5 180 top
R6  29.21,79.5 0 top
R7  57.15,74.36 90 top
R11  22.78,93.18 270 top
R12  38.61,90.81 90 top
R13  39.15,65.87 270 top
R14  50.04,94.61 90 top
R15  41.94,60.29 270 top
R16  37.8,72.21 270 top
R17  39.32,72.21 270 top
R18  37.29,67.14 270 top
SP1  39.74,53.44 90 top
SW2  57.93,84.49 270 top
SW3  17.13,91.34 0 bottom
TP1  3.81,19.05 0 top
TP2  55.88,19.05 0 top
TP3  12.7,100.33 0 top
TP4  55.88,100.33 0 top
TP5  49.53,80.01 0 top
TP6  20.83,95.5 0 top
U1  26.91,92.71 0 top
U2  RT9080-3.3  [SOT23-5']  43.56,85.72 90 top
U3  39.49,60.54 180 top
U$1  48.9,10.79 180 bottom
U$2  29.84,10.79 180 bottom
U$3  10.79,10.79 180 bottom
U$4  10.79,29.84 180 bottom
U$5  29.84,29.84 180 bottom
U$6  48.9,29.84 180 bottom
U$12  10.79,67.94 180 bottom
U$13  29.84,67.94 180 bottom
U$34  50.93,102.23 0 top
U$35  3.31,3.1 0 top
U$40  48.9,67.94 180 bottom
U$41  10.79,48.9 180 bottom
U$42  29.84,48.9 180 bottom
U$43  48.9,48.9 180 bottom
U$79  50.73,101.81 0 bottom
U$80  56.64,13.72 0 top
U$81  [PCBFEAT-REV-040]  50.04,97.92 0 top
U$83  28.16,88.53 0 bottom
X1  29.84,100.2 180 top
X2  41.8,99.06 180 top
Y1  27.56,77.34 180 top

### Tracks (layer width: path | path; a pad name or v marks a point on that pad's centre or on a via)
1.2V  (via drill 0.5)
  Top 0.203: IC3.50 31.04,91.68 C4.2 31.11,91.61 31.11,90.55 v31.47,90.55 | IC3.45 33.04,90.06 33.53,90.55 v33.55,90.55 33.55,90.99 33.66,91.1 C11.1 | C3.2 31.84,80.2 IC3.23 31.84,80.51 v31.81,80.51
  Bottom 0.203: v31.81,80.51 31.81,81.52 33.55,83.26 v33.55,90.55 v31.47,90.55
3.3V  (via drill 0.39, 0.5)
  Top 0.203: IC3.49 31.5,89.3 | 31.5,89.3 IC3.48 31.84,88.68 32.13,88.39 33.15,88.39 33.27,88.52 | IC3.43 33.84,89.41 33.55,89.41 IC3.44 33.44,88.69 33.27,88.52 | C5.1 27.08,88.45 IC3.1 28.83,88.45 | 28.83,88.45 31.18,88.45 31.5,88.77 31.5,89.3 | 33.27,85.6 33.27,88.52 | 33.27,85.6 34.02,84.85 IC3.33 36.85,84.85 37.34,85.34 | C10.1 25.27,83.57 26.56,84.85 IC3.10 28.72,84.85 28.83,84.96 28.83,88.45 | IC3.42 35.62,88.45 | 33.27,85.6 33.27,83.69 31.88,83.69 31.44,83.26 IC3.22 31.44,81.26 30.93,80.75
  Top 0.254: C31.2 30.93,78.5 30.93,80.75 | C7.2 50.43,90.87 50.82,90.48 50.82,88.7 v50.73,88.61 | v45.58,87.82 45.3,88.1 45.22,88.1 44.25,89.07 C21.2 42.98,89.07 42.8,88.88 42.8,87.76 | v47.1,94.28 49.12,94.28 R14.7
  Top 0.305: CONN1.2 50.94,92.21 49.59,90.87 | C16.1 R2.1 24.22,96.01 24.47,96.27 25.23,96.27 26.12,95.38 27.29,95.38 27.56,95.11 | IC3.43 34.15,89.3 C2.1 35.56,89.95 C13.1 36.7,88.52 C1.1 | C8.1 41.95,85.09 U2.5 43.24,85.76 43.24,87.31 42.8,87.76 | C7.2 49.4,93.1 R14.8 R14.7 R14.6 | v37.47,85.34 37.34,85.34 | U1.8 27.56,95.11 | 27.56,95.11 v27.56,95.25
  Top 0.406: 49.59,90.87 C7.2 | C8.1 38.82,85.09 | 35.62,88.45 36.8,88.45 C1.1 | C12.1 38.82,85.09 | 38.82,85.09 37.72,85.09 v37.47,85.34
  Bottom 0.254: X2.5 40.05,99.13 40.16,99.02 40.59,99.02 | 40.59,99.02 40.84,99.02 41.05,99.22 X2.7 | v50.73,88.61 47.08,88.61 47.05,88.64 46.39,88.64 v45.58,87.82 | v47.1,94.28 46.34,95.04 44.31,95.04 43.04,93.77 41.09,93.77 40.59,94.28 40.59,99.02
  Bottom 0.305: v27.56,95.25 27.69,95.25 27.81,95.38 30.86,95.38 35.5,90.74 36.99,90.74 37.34,90.39 37.34,85.47 v37.47,85.34
5.0V  (via drill 0.48, 0.5)
  Top 0.305: X1.B4A9 27.45,98.53 27.64,98.72 27.64,99.61 | X1.A4B9 32.24,98.48 31.83,98.9
  Top 0.406: 27.64,99.61 v27.84,99.82 | v31.83,100.08 31.83,98.9 | LED3.1-VDD 8.14,71.01 v8,70.87 | LED2.1-VDD 27.2,71.14 v27.05,70.99 | LED1.1-VDD 46.24,71.01 v46.23,70.99 45.59,70.99 C24.2 44.35,71.91 C29.1 | LED4.1-VDD 46.24,52.73 v45.3,51.78 | LED5.1-VDD v25.54,53.1 | v25.54,53.1 v25.53,53.09 | LED6.1-VDD 8.14,52.59 v7.49,51.94 | LED9.1-VDD 8.14,32.91 v8,32.77 | LED8.1-VDD 25.67,33.92 v25.65,33.91 C22.2 24.32,32.36 C26.1 | LED7.1-VDD 44.84,34.05 v44.83,34.04 | LED10.1-VDD 44.84,15 v44.83,14.99 | LED11.1-VDD 27.18,15.11 v25.91,15.11 C23.2 24.22,15.01 C27.1 | LED12.1-VDD 6.74,14.87 v6.73,14.86 | v56.64,71.63 56.42,71.85 IC1.5 | v48.26,84.71 46.83,84.71 C6.1 46.57,84.78 U2.1 44.26,84.78 43.81,85.22 43.81,86.36 44.13,86.67 U2.3 44.86,87.35 44.62,87.59 v44.24,87.59 | v25.54,53.1 24.2,53.1 C25.2 24.09,52.99 C28.1 | U3.6 39.16,59.52 38.81,59.87 v38.81,60.2 38.66,60.05 C18.2 | C18.2 | C18.2 C30.2
  Bottom 0.406: v27.84,99.82 28.1,100.08 29.97,100.08 | 29.97,100.08 v31.83,100.08 | v48.26,84.71 48.9,84.71 48.9,75.18 | v44.24,87.59 40.9,87.59 29.97,98.51 29.97,100.08
  pour Bottom: 0,0 59.69,0 59.69,75.56 0,75.56
!RESET  (via drill 0.5)
  Top 0.203: R14.1 52.1,93.31 v52.32,93.09 | v56.64,87.88 57.01,87.51 SW2.2 57.01,84.32 53.47,80.77 49.53,80.77 33.66,80.77 33.04,81.39 IC3.26
  Top 0.406: TP5.P$1 49.53,80.77
  Bottom 0.203: v52.32,93.09 52.32,90.3 54.99,87.63 56.39,87.63 v56.64,87.88
CC1
  Top 0.203: R1.7 25.42,100.6 26.42,101.6 30.23,101.6 31.09,100.73 X1.A5
CC2
  Top 0.203: R1.6 24.62,99.8 25.04,100.22 25.58,100.22 26.57,101.22 27.94,101.22 28.57,100.58 28.57,99.19 28.07,98.68 28.07,97.96 X1.B5
D+
  Top 0.203: R3.2 30.57,95.29 32.24,93.61 IC3.47
D-
  Top 0.203: R4.2 32.64,94.78 IC3.46
GND  (via drill 0.39, 0.5)
  Top 0.203: IC3.19 30.24,85.85 | U1.4 26.8,91.51 26.8,92.71 v26.92,92.71
  Top 0.254: 30.24,85.85 IC3.P$1 | C10.2 22.6,83.57 v22.24,83.2 | R12.1 38.61,88.56 C1.2 | U$40.2 41.12,65.86 39.66,65.86 | SW3.D SW3.C | SW3.P$1 20.91,97.19 21.08,97.03
  Top 0.406: C6.2 45.94,85.72 U2.2 | 20.76,97.35 21.08,97.03 C16.2
  Bottom 0.305: SW3.C 15.89,91.67 15.95,91.72 21.06,91.72 21.06,88.64 18.23,85.81 SW3.P$2
  other vias: 52.48,97.49 35.63,100.57 40.43,102.79 47.33,100.49 58.42,93.85 58.42,91.69 53.09,91.06 37.34,93.34 37.59,84.2 43.69,83.19 48.39,86.49 46.74,87.88 49.91,87.5 31.24,85.85 26.67,96.52 33.78,96.77 20.95,103.12 29.72,94.36 20.83,97.54 21.84,89.66 51.31,83.19 53.85,85.98 55.37,81.15 51.31,79.12 35.44,95.29
  pour Top: 20.3,75.87 20.26,75.84 20.22,75.82 0,75.82 0,0 59.69,0 59.69,104.14 20.32,104.14 20.32,75.92
  pour Bottom: 20.32,76.07 59.82,76.07 59.82,104.01 20.32,104.01
GP1  (via drill 0.5)
  Top 0.203: IC3.3 27.77,87.63 25.2,87.63 24.4,86.83 21.62,86.83 16.92,82.12 16.92,79.82 v16.79,79.7 | v44.92,60.75 45.21,60.45 53.47,60.45 54.98,61.97 U$40.1
  Bottom 0.203: v16.79,79.7 17.06,79.97 21.09,75.95 32.89,75.95 34.54,74.3 34.54,70.15 39.76,64.93 39.76,62.19 41.2,60.75 v44.92,60.75
GP2  (via drill 0.5)
  Top 0.203: IC3.4 27.77,87.23 25.34,87.23 24.55,86.45 21.78,86.45 17.55,82.22 v17.55,78.43 | v35.56,65.28 36.07,64.77 36.07,62.23 35.94,62.36 U$13.1
  Bottom 0.203: v17.55,78.43 24.89,71.09 24.89,70.62 26.92,68.59 26.92,67.44 29.08,65.28 v35.56,65.28
GP3
  Top 0.203: IC3.5 25.49,86.85 24.71,86.07 21.94,86.07 18.54,82.67 18.54,72.77 17.53,71.75 17.53,63.51 U$12.1
GP4  (via drill 0.5)
  Top 0.203: IC3.6 25.63,86.45 24.87,85.69 22.1,85.69 18.92,82.52 18.92,72.55 18.03,71.66 18.03,70.45 19.3,69.18 19.3,62.97 22.58,59.69 v23.09,59.69 | v27.81,39.88 51.56,39.88 54.48,42.8 54.48,43.56 54.74,43.81 U$43.1
  Bottom 0.203: v23.09,59.69 23.09,44.73 27.81,40.01 v27.81,39.88
GP5  (via drill 0.5)
  Top 0.203: IC3.7 25.89,86.05 25.11,85.27 22.22,85.27 19.3,82.36 19.3,72.39 18.41,71.5 18.41,70.61 19.68,69.34 19.68,63.25 22.23,60.71 v22.61,60.71 | v24.13,42.55 25.91,40.77 32.89,40.77 U$42.1
  Bottom 0.203: v22.61,60.71 22.36,60.46 22.36,44.31 v24.13,42.55
GP6  (via drill 0.5)
  Top 0.203: IC3.8 26.14,85.65 25.36,84.87 22.36,84.87 19.68,82.2 19.68,71.5 v19.18,70.99 | v17.91,46.61 17.91,44.84 U$41.1
  Bottom 0.203: v17.91,46.61 19.3,48.01 19.3,70.87 v19.18,70.99
GP7  (via drill 0.5)
  Top 0.203: IC3.9 26.39,85.25 25.63,84.49 22.51,84.49 20.07,82.04 20.07,63.64 21.86,61.85 v22.35,61.85 | v40.01,22.48 40.02,22.5 52.72,22.5 U$6.1
  Bottom 0.203: v22.35,61.85 21.84,61.34 21.84,28.19 27.56,22.48 v40.01,22.48
GP8  (via drill 0.5)
  Top 0.203: IC3.11 26.98,84.45 26.16,83.63 26.16,82.96 25.62,82.42 22.48,82.42 20.57,80.51 20.57,63.8 21.51,62.87 v21.97,62.87 | v26.29,22.61 27.05,21.84 33.01,21.84 U$5.1
  Bottom 0.203: v26.29,22.61 21.46,27.43 21.46,62.36 v21.97,62.87
GP9  (via drill 0.5)
  Top 0.203: IC3.12 27.12,84.05 26.54,83.47 26.54,82.8 25.78,82.04 22.64,82.04 21.02,80.42 21.02,72.45 v21.53,71.94 | v17.78,27.43 17.78,25.66 U$4.1
  Bottom 0.203: v21.53,71.94 21.53,71.56 19.75,69.79 19.75,29.4 v17.78,27.43
GP10  (via drill 0.5)
  Top 0.203: U$1.1 54.98,4.44 52.83,2.29 23.24,2.29 19.56,5.97 v19.56,15.62 | v21.75,70.61 22.38,71.25 22.38,72.52 21.49,73.41 21.49,80.36 22.8,81.66 26.04,81.66 26.92,82.55 26.92,83.32 27.26,83.65 IC3.13
  Bottom 0.203: v19.56,15.62 20.19,16.26 20.19,69.12 21.69,70.61 v21.75,70.61
GP11  (via drill 0.5)
  Top 0.203: IC3.14 27.41,82.87 27.41,82.47 26.22,81.28 22.96,81.28 21.87,80.2 21.87,73.56 22.76,72.67 22.76,70.51 21.46,69.22 v21.46,67.56 | v20.32,13.84 20.32,6.6 23.75,3.17 33.4,3.17 U$2.1
  Bottom 0.203: v21.46,67.56 20.95,67.06 20.95,14.48 v20.32,13.84
GP12  (via drill 0.5)
  Top 0.203: IC3.15 27.88,82.4 26.38,80.9 23.11,80.9 22.25,80.04 22.25,73.72 23.14,72.83 23.14,69.75 22.42,69.03 v22.48,68.96 | v18.67,14.48 18.67,7.11 16.76,5.21 16.76,5.59 U$3.1
  Bottom 0.203: v22.48,68.96 21.59,68.96 20.57,67.94 20.57,15.24 19.81,14.48 v18.67,14.48
IN+
  Top 0.254: U3.3 39.16,65.01 R13.2
IN-
  Top 0.254: U3.4 38.51,63.97 37.29,65.19 R18.2
LED  (via drill 0.5)
  Top 0.203: IC3.16 29.04,81.75 28.9,81.61 27.74,81.61 26.6,80.46 26.22,80.46 v25.9,80.15 | v21.08,101.47 21.11,101.5 R1.1
  Bottom 0.203: v25.9,80.15 25.9,92.34 22.1,96.14 22.1,100.46 v21.08,101.47
MOSI  (via drill 0.39)
  Top 0.178: IC3.39 36.34,87.25 36.58,87.49 39.63,87.49 40.42,88.28 40.42,97.75 40.85,98.18 v43.38,98.18
  Bottom 0.178: X2.12 43.55,99.37 43.39,99.21 v43.39,98.19 v43.38,98.18
N$1
  Top 0.203: X1.B6 29.09,97.04 | R3.1 28.87,96.81 29.09,97.04 | 29.09,97.04 29.23,96.9 29.97,96.9 30.09,97.02 X1.A6
N$2
  Top 0.203: L.A 23.96,103.02 R1.8
N$3
  Top 0.203: R4.1 32.47,96.65 30.85,96.65 30.59,96.9 X1.B7 30.55,97.97 30.55,98.86 30.48,98.93 29.72,98.93 29.56,98.78 29.56,97.96 X1.A7
N$4
  Top 0.203: R11.2 22.78,90.88 D3.A
N$5
  Top 0.203: C19.2 26.73,75.08 Y1.3 27.5,77.48 27.5,80.07 27.94,80.52 29.34,80.52 30.64,81.82 IC3.20
N$6
  Top 0.203: R6.1 28.36,78.07 C20.2 28.48,78.07 Y1.1
N$7
  Top 0.203: IC3.21 31.04,81.5 30.06,80.52 R6.2
N$10
  Top 0.203: LED2.4-DIN 33.03,72.15 35.23,74.35 45.55,74.35 LED1.2-DOUT
N$11
  Top 0.203: LED3.4-DIN 13.45,66.66 10.92,64.14 10.92,61.59 14.22,58.29 25.65,58.29 28.19,60.83 28.19,66.08 26.9,67.37 26.9,69.23 25.65,70.48 25.65,73.15 26.15,73.65 LED2.2-DOUT
N$12
  Top 0.203: LED4.2-DOUT 44.62,53.1 LED5.4-DIN
N$13
  Top 0.203: LED6.4-DIN 18.43,53.1 19.93,54.6 LED5.2-DOUT
N$14
  Top 0.203: LED8.4-DIN 39.38,33.92 41.01,35.55 LED7.2-DOUT
N$15
  Top 0.203: LED9.4-DIN 20.59,34.05 21.97,35.43 27.18,35.43 LED8.2-DOUT
N$16
  Top 0.203: LED11.4-DIN 39.13,15.12 40.77,16.76 45.98,16.76 LED10.2-DOUT
N$17
  Top 0.203: LED12.4-DIN 16.9,14.87 18.66,16.62 LED11.2-DOUT
N$18
  Top 0.203: LED3.2-DOUT 7.61,73.65 6.99,73.03 6.99,69.6 8.49,68.09 8.49,66.99 9.53,65.95 9.53,62.45 14.14,57.84 31.71,57.84 35.18,54.37 44.65,54.37 44.65,55.81 45.91,57.08 52.2,57.08 53.72,55.55 53.72,54.48 52.46,53.23 LED4.4-DIN
N$19
  Top 0.203: LED6.2-DOUT 6.97,54.6 6.73,54.36 6.73,51.05 8.49,49.3 8.49,47.94 9.53,46.9 9.53,44.58 15.37,38.73 52.32,38.73 53.47,37.59 53.47,34.8 52.72,34.05 LED7.4-DIN
N$20
  Top 0.203: LED10.4-DIN 52.59,15 53.09,15.49 53.09,17.03 52.48,17.64 52.48,17.75 50.04,20.19 13.59,20.19 9.27,24.51 9.27,28.11 8.49,28.89 8.49,29.74 6.6,31.62 6.6,34.54 7.61,35.55 LED9.2-DOUT
N$21  (via drill 0.39)
  Top 0.178: R12.2 38.61,97.38 40.14,98.91 v44.05,98.91
  Bottom 0.178: v44.05,98.91 X2.13
N$23  (via drill 0.39)
  Top 0.178: C17.1 46.76,89.8 46.76,91.74 46.48,92.02 46.48,92.78 v46.37,92.9
  Bottom 0.178: X2.2 38.55,99.07 38.62,98.99 38.62,93.47 39.42,92.67 43.5,92.67 43.73,92.9 v46.37,92.9
N$24  (via drill 0.39)
  Top 0.178: C17.2 47.62,91.72 47.6,91.74 47.6,91.84 v47.15,92.3
  Bottom 0.178: X2.1 38.05,99.06 38.27,98.85 38.27,93.32 39.35,92.23 46.64,92.23 46.71,92.3 v47.15,92.3
N$25  (via drill 0.39)
  Top 0.178: C15.1 44.9,89.89 44.9,92.78 44.98,92.87 v44.98,94.28
  Bottom 0.178: v44.98,94.28 44.39,93.69 43.51,93.69 43.2,93.38 40.93,93.38 40.62,93.69 39.55,93.69 X2.4
N$26  (via drill 0.39)
  Top 0.178: C15.2 45.83,90.66 45.83,91.74 45.37,92.21 45.37,92.75 45.57,92.96 45.57,93.49 v45.68,93.59
  Bottom 0.178: v45.68,93.59 45.42,93.33 43.66,93.33 43.35,93.02 39.56,93.02 39.05,93.54 X2.3
N$28
  Top 0.254: C32.2 39.67,66.72 R13.1
N$29
  Top 0.254: R16.2 | R16.2 R17.2 C33.2 | C33.2 | C33.2 C32.1
N$30
  Top 0.254: C34.1 37.32,69.02 R18.1
N$31
  Top 0.406: U3.5 38.51,57.81 SP1.-
N$32
  Top 0.406: U3.8 42.54,56.26 SP1.+
NEOPIX  (via drill 0.5)
  Top 0.203: v54.48,75.95 IC1.2 | v53.34,81.92 52.83,81.41 38.14,81.41 35.9,83.65 IC3.30
  Top 0.254: R7.2 57,75.21 56.26,75.95 v54.48,75.95
  Bottom 0.203: v53.34,81.92 53.34,77.09 v54.48,75.95
NEOPIX_5V
  Top 0.203: LED1.4-DIN 53.24,72.15 IC1.4
OLED_CS  (via drill 0.39)
  Top 0.178: IC3.34 35.73,85.25 36.02,85.54 36.64,85.54 37.17,86.06 40.22,86.06 41.84,87.69 41.84,94.26 v42.15,94.57
  Bottom 0.178: v42.15,94.57 41.26,95.45 41.26,98.85 41.55,99.13 X2.8
OLED_DC  (via drill 0.39)
  Top 0.178: IC3.36 35.48,86.05 35.69,86.25 36.35,86.25 36.87,86.78 39.92,86.78 41.13,87.98 41.13,96.43 41.35,96.65 42.52,96.65 v42.7,96.46
  Bottom 0.178: X2.10 42.55,98.97 42.07,98.48 42.07,97.1 v42.7,96.46
OLED_RST  (via drill 0.39)
  Top 0.178: IC3.35 35.63,85.65 35.87,85.9 36.5,85.9 37.02,86.42 40.07,86.42 41.48,87.83 41.48,95.52 41.77,95.8 42.3,95.8 v42.62,95.49 | R14.4 50.89,98.52 49.89,99.52 46.42,99.52 45.49,98.59 v45.49,97.92
  Bottom 0.178: X2.9 42.05,98.97 41.71,98.63 41.71,96.39 v42.62,95.49 43.65,95.49 45.49,97.33 v45.49,97.92
QSPI_CS
  Top 0.203: IC3.56 28.27,89.3 27.4,90.17 24.43,90.17 23.62,90.98 23.62,92.96 | 23.62,92.96 24.57,93.91 U1.1 | R2.2 22.52,95.25 22.52,94.3 R11.1 23.62,93.19 23.62,92.96
  Top 0.254: TP6.P$1 22.26,95.5 22.52,95.25
QSPI_DATA[0]
  Top 0.203: IC3.53 29.84,90.3 28.76,91.38 U1.5
QSPI_DATA[1]
  Top 0.203: U1.2 24.53,93.11 24,92.58 24,91.13 24.59,90.55 28.32,90.55 28.85,90.02 28.86,90.02 29.04,89.83 IC3.55
QSPI_DATA[2]
  Top 0.203: IC3.54 29.44,90.04 28.55,90.93 25.8,90.93 25.79,90.93 24.74,90.93 24.38,91.29 24.38,91.82 24.87,92.31 U1.3
QSPI_DATA[3]
  Top 0.203: IC3.51 30.62,89.32 30.62,90.6 29.72,91.5 29.72,92.33 28.94,93.11 U1.7
QSPI_SCK
  Top 0.203: U1.6 29.1,92.31 29.34,92.07 29.34,91.34 30.24,90.44 IC3.52
ROTA  (via drill 0.5)
  Top 0.203: IC3.28 34.41,82.4 v34.67,82.14
  Bottom 0.203: v34.67,82.14 34.67,81.25 32.29,78.87 25.46,78.87 22.8,81.53 14.82,81.53 14.12,82.23 14.12,87.39 SW3.A
ROTB  (via drill 0.5)
  Top 0.203: v35.81,82.3 34.86,83.25 IC3.29
  Bottom 0.203: v35.81,82.3 35.81,81.79 32.45,78.42 25.31,78.42 22.7,81.03 13.54,81.03 12.96,81.61 12.96,91.23 SW3.B
SCK  (via drill 0.39)
  Top 0.178: IC3.38 35.63,86.85 35.87,86.61 36.2,86.61 36.73,87.13 39.77,87.13 40.77,88.13 40.77,97.09 41.26,97.58 42.6,97.58 v42.73,97.44
  Bottom 0.178: v42.73,97.44 42.73,97.88 42.63,97.99 42.63,98.54 43.02,98.93 43.03,98.93 43.03,99.36 43.05,99.37 X2.11
SCL  (via drill 0.5)
  Top 0.203: R14.3 52.43,95.02 53.24,94.21 CONN1.4 56.11,94.21 v56.13,94.23 | IC3.32 36.23,84.45 38.51,82.17 51.91,82.17 55.02,85.28 v55.02,89.28
  Bottom 0.203: v55.02,89.28 55.02,93.12 v56.13,94.23
SDA
  Top 0.203: R14.2 52.34,94.22 53.35,93.21 CONN1.3 55.25,93.21 55.75,92.71 55.75,85.47 52.07,81.79 38.35,81.79 36.09,84.05 IC3.31
SPEAKER  (via drill 0.5)
  Top 0.203: IC3.27 33.44,81.75 33.98,81.21 36.27,81.21 v36.78,81.72
  Top 0.254: v36.39,72.45 37.19,72.45 R16.1
  Bottom 0.203: v36.78,81.72 36.51,81.72 35.05,80.26 35.05,74.86 35.56,74.36 35.56,73.28 v36.39,72.45
SPKR_SD  (via drill 0.39, 0.5)
  Top 0.203: IC3.17 29.42,82.38 29.42,81.59 28.99,81.15 27.95,81.15 25.37,78.57 v25.37,77.42 | U3.1 40.55,62.66 v41.43,62.66 41.43,61.65 R15.1
  Bottom 0.203: v25.37,77.42 26.46,76.33 33.05,76.33 34.99,74.39 34.99,70.37 40.14,65.22 40.14,63.95 v41.43,62.66
USBBOOT
  Top 0.178: 21.91,88.45 21.52,88.84
  Top 0.203: IC3.2 22.97,88.05 22.81,88.21 D3.C 22.1,88.27 21.91,88.45
  Top 0.254: 21.52,88.84 18.38,91.98 SW3.E
VCC  (via drill 0.39)
  Top 0.178: C14.2 46.14,101.88 v45.74,101.48
  Bottom 0.178: v45.74,101.48 45.39,101.48 45.21,101.3 45.21,101.09 45.05,100.93 X2.15
VCOMH  (via drill 0.39)
  Top 0.178: C9.2 44.4,101.65 v44.55,101.5
  Bottom 0.178: v44.55,101.5 X2.14